# Altium project TinyGS_Ground_PCB_Project.PrjPcb
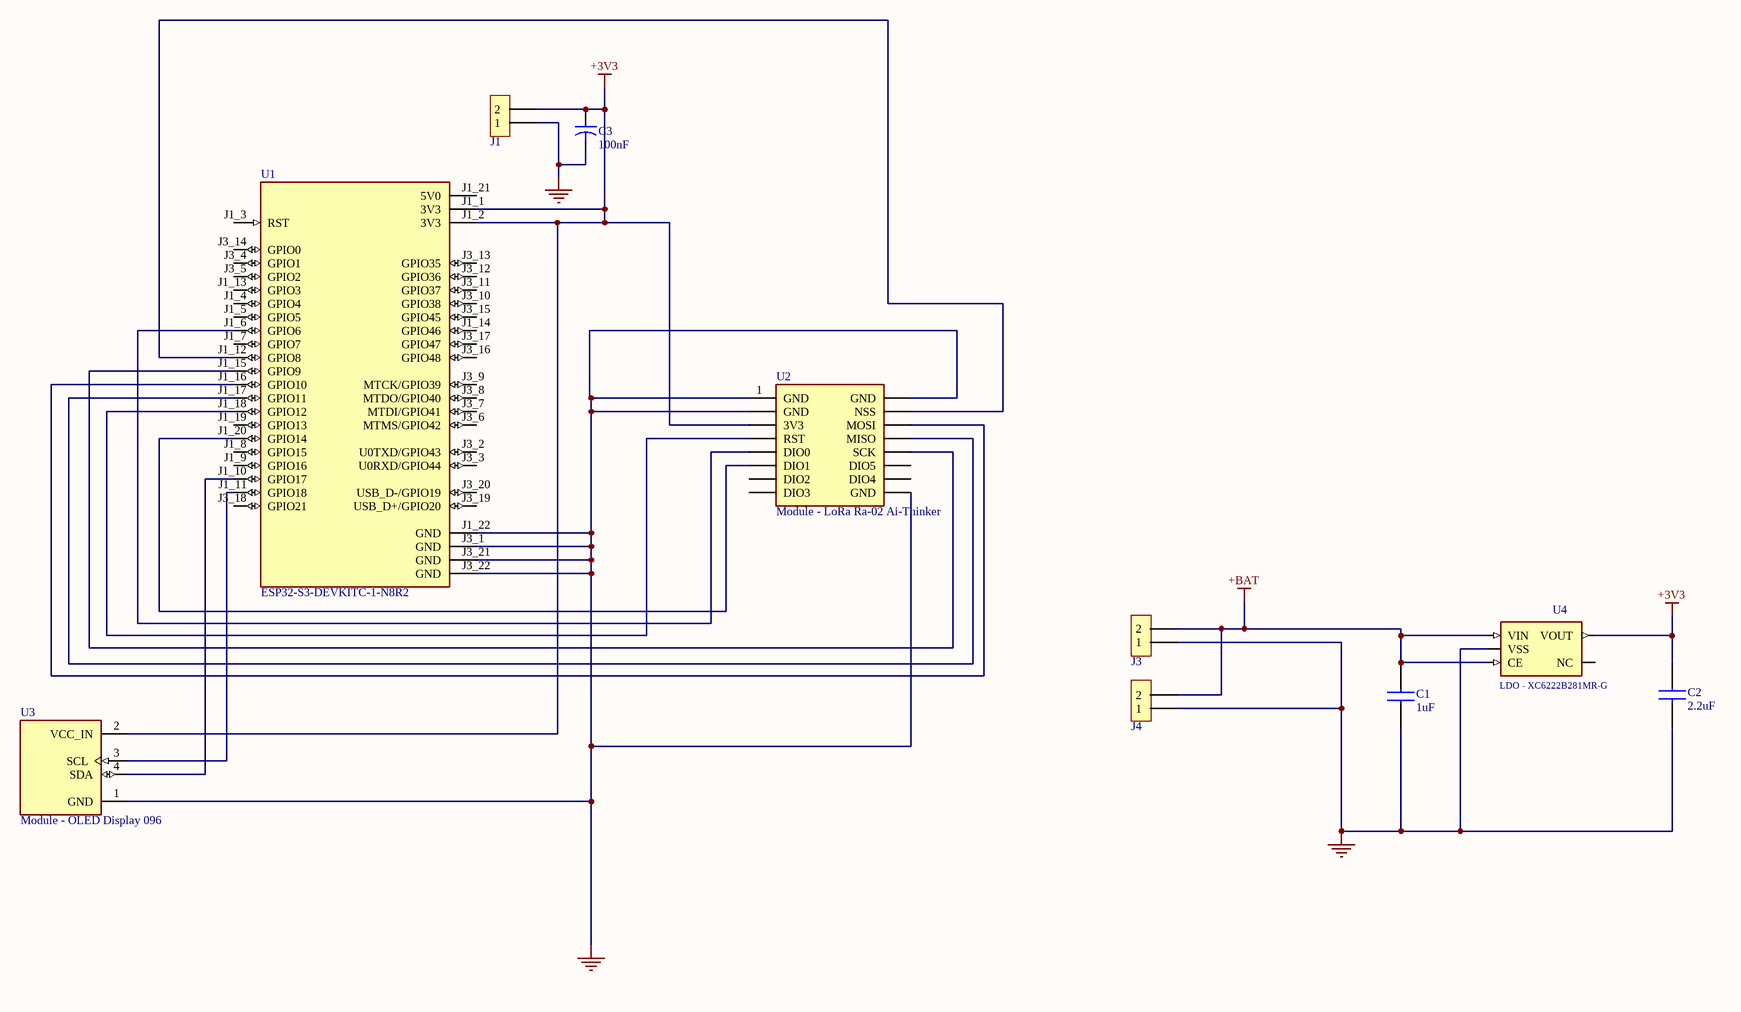
[diagram p0: GSv1_schematic.SchDoc]
1 sheet, 10 parts. Net scope: global (net labels, ports and power ports of the same name join across sheets).
Board file: GSv1_PCB.PcbDoc

## Sheet GSv1_schematic.SchDoc
size A3; Author: Mr. Henrique Chaves; CompanyName: Instituto de Telecomunicações; Organization: Instituto de Telecomunicações; Address1: Campus Santiago; Address2: Universidade de Aveiro; Address3: Aveiro, Portugal; Address4: Address Line 4; SheetNumber: 1; SheetTotal: 1

### Parts
C1  1uF  [0805]
C2  2.2uF  [0805]
C3  value 100nF  [DIP_Electrolytic_Capacitor]  (hidden comment: DIP - Electrolytic Capacitor)
J1  J - Header 2.54mm 2Pos 1Row  [Header 2.54mm 2Pos 1Row]  (value not drawn)
J3  J - Header 2.54mm 2Pos 1Row  [Header 2.54mm 2Pos 1Row]  (value not drawn)
J4  J - Connector 5.08mm 2Pos  [CONNECTOR 508mm 2POS]  (value not drawn)
U1  ESP32-S3-DEVKITC-1-N8R2  [ORIGINAL_ESP32-S3-DEVKITC_1]
U2  Module - LoRa Ra-02 Ai-Thinker  [MODULE LoRa Ra-02 Ai Thinker_separate rows]
U3  Module - OLED Display 096  [MODULE_DM-OLED096-636]
U4  LDO - XC6222B281MR-G  [SOT25]

### Nets
+3V3: C2.2 C3.1 J1.2 U1.J1_1(3V3) U1.J1_2(3V3) U2.3(3V3) U3.2(VCC_IN) U4.P$4(VOUT)
+BAT: C1.2 J3.2 J4.2 U4.P$1(VIN) U4.P$3(CE)
GND: C1.1 C2.1 C3.2 J1.1 J3.1 J4.1 U1.J1_22(GND) U1.J3_1(GND) U1.J3_21(GND) U1.J3_22(GND) U2.1(GND) U2.2(GND) U2.9(GND) U2.16(GND) U3.1(GND) U4.P$2(VSS)
NetU1_J1_6: U1.J1_6(GPIO6) U2.5(DIO0)
NetU1_J1_10: U1.J1_10(GPIO17) U3.4(SDA)
NetU1_J1_11: U1.J1_11(GPIO18) U3.3(SCL)
NetU1_J1_12: U1.J1_12(GPIO8) U2.10(NSS)
NetU1_J1_15: U1.J1_15(GPIO9) U2.13(SCK)
NetU1_J1_16: U1.J1_16(GPIO10) U2.11(MOSI)
NetU1_J1_17: U1.J1_17(GPIO11) U2.12(MISO)
NetU1_J1_18: U1.J1_18(GPIO12) U2.4(RST)
NetU1_J1_20: U1.J1_20(GPIO14) U2.6(DIO1)

Not connected (* = marked no-connect by the designer): U1 J1_3(RST) J1_4(GPIO4) J1_5(GPIO5) J1_7(GPIO7) J1_8(GPIO15) J1_9(GPIO16) J1_13(GPIO3) J1_14(GPIO46) J1_19(GPIO13) J1_21(5V0) J3_2(U0TXD/GPIO43) J3_3(U0RXD/GPIO44) J3_4(GPIO1) J3_5(GPIO2) J3_6(MTMS/GPIO42) J3_7(MTDI/GPIO41) J3_8(MTDO/GPIO40) J3_9(MTCK/GPIO39) J3_10(GPIO38) J3_11(GPIO37) J3_12(GPIO36) J3_13(GPIO35) J3_14(GPIO0) J3_15(GPIO45) J3_16(GPIO48) J3_17(GPIO47) J3_18(GPIO21) J3_19(USB_D+/GPIO20) J3_20(USB_D-/GPIO19); U2 7(DIO2) 8(DIO3) 14(DIO5) 15(DIO4); U4 P$5(NC)

### Notes on the sheet
- Title:
- Author:
- Approved:
- Size:
- Date:
- Git Hash:
- A3
- Prj:
- SW Version:
- Edited:
- File:

### Library data of the parts
C1 C2 = CAP - SMD_0805(inch): SMD Ceramic Capacitor
C3 = DIP - Electrolytic Capacitor: Capacitor; Published: 23-Sep-2002; PackageReference: CAPR5-4X5; Publisher: Altium Limited; PackageDescription: Capacitor; 2 Leads
U1 = ESP32-S3-DEVKITC-1-N8R2: WiFi Development Tools - 802.11 (Engineering Samples Only) ESP32-S3 General-Purpose Development Board, ESP32-S3-WROOM-1-N8R2, with Pin Header; MF: Espressif Systems; SnapEDA_Link: https://www.snapeda.com/parts/ESP32-S3-DEVKITC-1-N8R2/Espressif+Systems/view-part/?ref=snap; Value: *; Purchase-URL: https://pricing.snapeda.com/search/part/ESP32-S3-DEVKITC-1-N8R2/?ref=eda; MP: ESP32-S3-DEVKITC-1-N8R2; Availability: In Stock; Check_prices: https://www.snapeda.com/parts/ESP32-S3-DEVKITC-1-N8R2/Espressif+Systems/view-part/?ref=eda; Package: None; Price: None
U2 = Module - LoRa Ra-02 Ai-Thinker: LoRa 433 MHz Module
U3 = Module - OLED Display 096: 0.96â€ 128 X 64 MONOCHROME GRAPHIC OLED DISPLAY MODULE - I2C
U4 = LDO - XC6222B281MR-G: Linear Voltage Regulator IC 1 Output 700mA SOT-25; MF: Torex; SnapEDA_Link: https://www.snapeda.com/parts/XC6222B281MR-G/Torex/view-part/1149890/?ref=snap; Value: *; Purchase-URL: https://pricing.snapeda.com/search/part/XC6222B281MR-G/?ref=eda; Price: None; Availability: Warning; MP: XC6222B281MR-G; Package: SOT-753 Torex; Check_prices: https://www.snapeda.com/parts/XC6222B281MR-G/Torex/view-part/1149890/?ref=eda
J1 J3 = J - Header 2.54mm 2Pos 1Row: LatestRevisionDate: 17-Jul-2002; LatestRevisionNote: Re-released for DXP Platform.; Publisher: Altium Limited